# Altium project H2 Sensor.PrjPcb
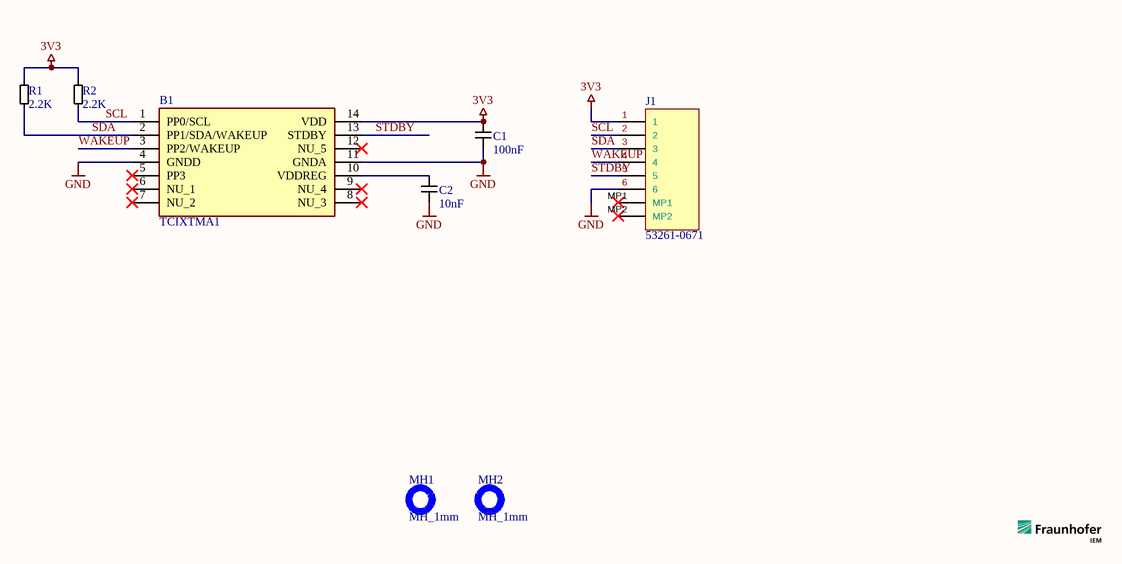
[diagram p0: H2 Sensor.SchDoc]
1 sheet, 8 parts. Net scope: global (net labels, ports and power ports of the same name join across sheets).
Board file: PCB2.PcbDoc

## Sheet H2 Sensor.SchDoc: TCIXTMA1
size A4; CompanyName: Fraunhofer IEM; DrawnBy: Farhan ul haq; DocumentNumber: H2 Sensor.SchDoc; Revision: 1; SheetNumber: 1; SheetTotal: 1

### Parts
B1  TCIXTMA1  [SOP65P890X370-14N]
C1  100nF  [Capacitor 0402_1005Metric SMD]
C2  10nF  [Capacitor 0402_1005Metric SMD]
J1  53261-0671  [53261-0671]
MH1  MH_1mm  [MountingHole_1mm_M1]
MH2  MH_1mm  [MountingHole_1mm_M1]
R1  2.2K  [Resistor 0402_1005Metric SMD]
R2  2.2K  [Resistor 0402_1005Metric SMD]

### Nets
3V3: B1.14(VDD) C1.1 J1.1 R1.2 R2.2
GND: B1.4(GNDD) B1.11(GNDA) C1.2 C2.2 J1.6
SCL: B1.1(PP0/SCL) J1.2 R2.1
SDA: B1.2(PP1/SDA/WAKEUP) J1.3 R1.1
STDBY: B1.13(STDBY) J1.5
WAKEUP: B1.3(PP2/WAKEUP) J1.4
NetB1_10: B1.10(VDDREG) C2.1

Not connected (* = marked no-connect by the designer): B1 5(PP3)* 6(NU_1)* 7(NU_2)* 8(NU_3)* 9(NU_4)* 12(NU_5)*; J1 MP1* MP2*

### Library data of the parts
B1 = TCIXTMA1: Air Quality Sensors XENSIV TCI Integrated Thermal Conductivity Gas Sensor , 3.135V ~ 3.465V ,-40C ~ 105C; Manufacturer_Name: Infineon; Geometry.Height: 3.7mm; Manufacturer_Part_Number: TCIXTMA1; Mouser Part Number: *; Mouser Price/Stock: *; Arrow Part Number: *; Arrow Price/Stock: *; Datasheet Link: https://www.infineon.com/assets/row/public/documents/24/49/infineon-tci-datasheet-en.pdf
C1 C2 = Capacitor 0402_1005Metric SMD
J1 = 53261-0671: PicoBlade 1x6 Horizontal / PCB Header 1.25mm Pitch
MH1 MH2 = MountingHole_1mm_M1
R1 R2 = Resistor 0402_1005Metric SMD